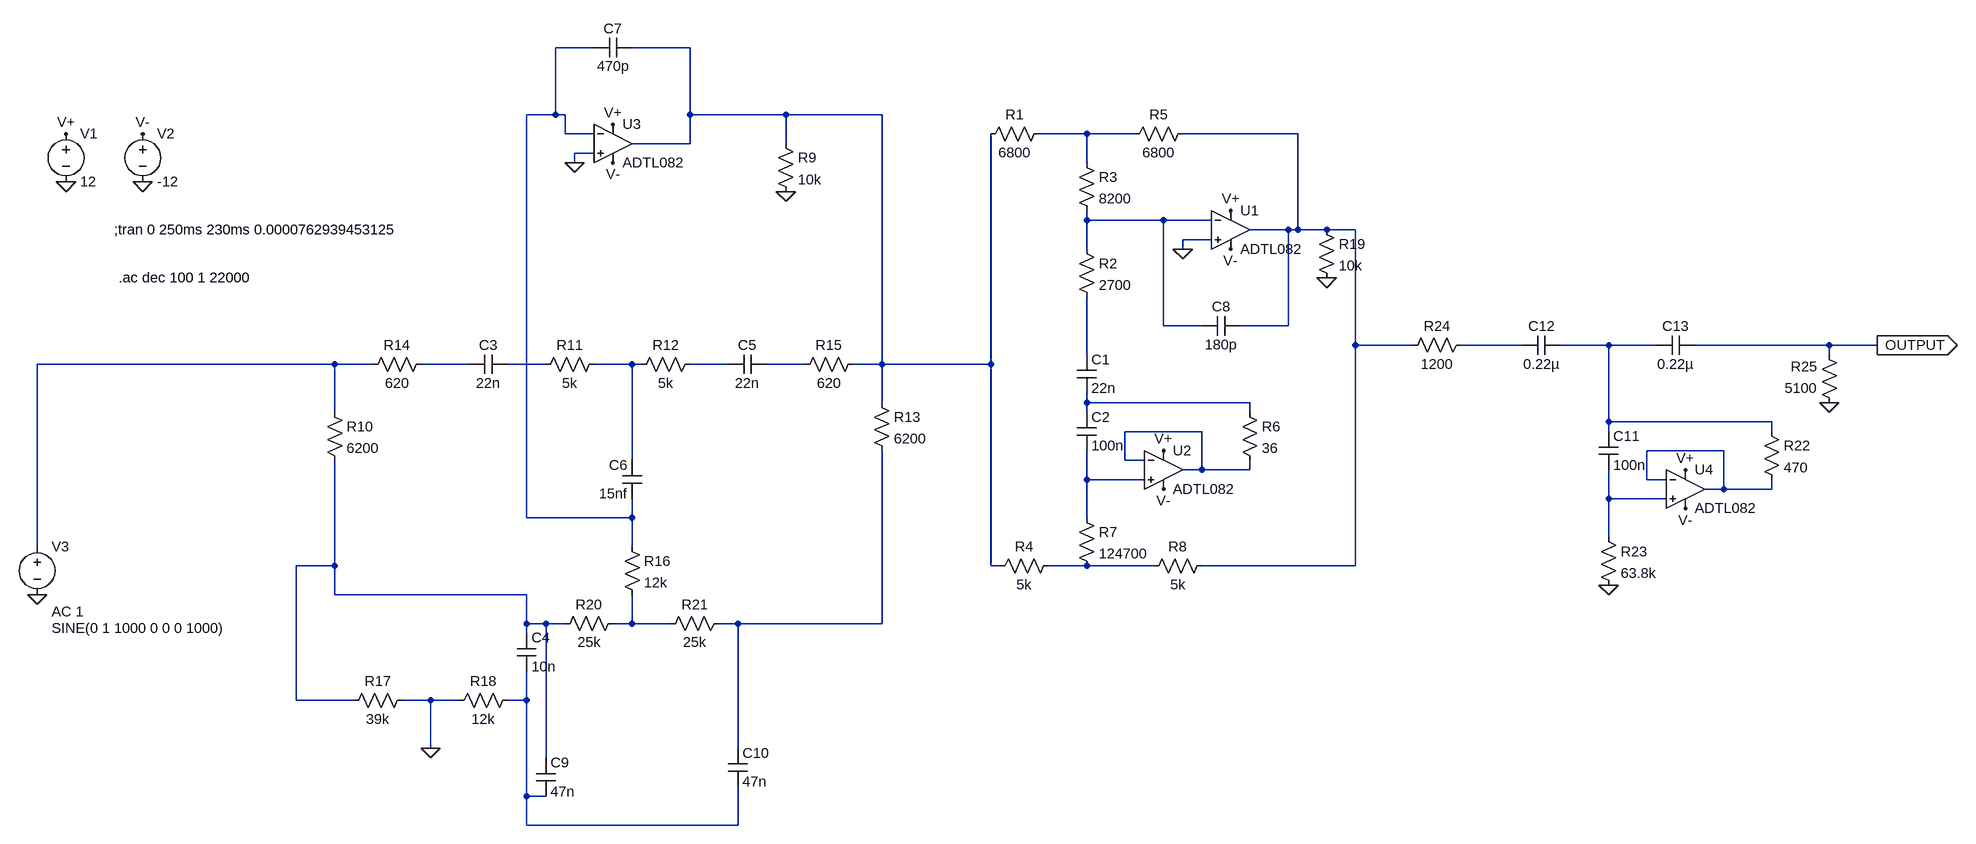
[diagram p0: schematic poormans_1073.asc]
poormans_1073.asc, the LTspice schematic file:
Version 4
SHEET 1 1724 1304
WIRE -1136 -144 -1200 -144
WIRE -976 -144 -1072 -144
WIRE -1200 -32 -1200 -144
WIRE -1200 -32 -1248 -32
WIRE -1184 -32 -1200 -32
WIRE -976 -32 -976 -144
WIRE -816 -32 -976 -32
WIRE -656 -32 -816 -32
WIRE -1184 0 -1184 -32
WIRE -1136 0 -1184 0
WIRE -256 0 -336 0
WIRE -176 0 -256 0
WIRE 96 0 -96 0
WIRE -976 16 -976 -32
WIRE -976 16 -1072 16
WIRE -816 16 -816 -32
WIRE -1136 32 -1168 32
WIRE -1168 48 -1168 32
WIRE -256 48 -256 0
WIRE -256 144 -256 128
WIRE -128 144 -256 144
WIRE -48 144 -128 144
WIRE 80 160 16 160
WIRE 96 160 96 0
WIRE 96 160 80 160
WIRE 144 160 96 160
WIRE 192 160 144 160
WIRE -48 176 -96 176
WIRE -256 192 -256 144
WIRE -96 192 -96 176
WIRE -128 320 -128 144
WIRE -64 320 -128 320
WIRE 80 320 80 160
WIRE 80 320 0 320
WIRE 192 352 192 160
WIRE 288 352 192 352
WIRE 480 352 368 352
WIRE 624 352 544 352
WIRE 704 352 624 352
WIRE 992 352 768 352
WIRE 1072 352 992 352
WIRE -256 368 -256 272
WIRE 992 368 992 352
WIRE -1568 384 -2064 384
WIRE -1504 384 -1568 384
WIRE -1344 384 -1424 384
WIRE -1216 384 -1280 384
WIRE -1072 384 -1136 384
WIRE -1056 384 -1072 384
WIRE -912 384 -976 384
WIRE -784 384 -848 384
WIRE -656 384 -656 -32
WIRE -656 384 -704 384
WIRE -416 384 -416 0
WIRE -416 384 -656 384
WIRE -656 448 -656 384
WIRE -256 448 -256 432
WIRE 16 448 -256 448
WIRE -1568 464 -1568 384
WIRE -256 464 -256 448
WIRE 16 464 16 448
WIRE 624 480 624 352
WIRE 896 480 624 480
WIRE -64 496 -192 496
WIRE 624 496 624 480
WIRE 896 496 896 480
WIRE 816 528 688 528
WIRE -1072 544 -1072 384
WIRE -192 544 -192 496
WIRE -160 544 -192 544
WIRE -64 560 -64 496
WIRE -64 560 -96 560
WIRE 16 560 16 544
WIRE 16 560 -64 560
WIRE -256 576 -256 528
WIRE -160 576 -256 576
WIRE 688 576 688 528
WIRE 720 576 688 576
WIRE 816 592 816 528
WIRE 816 592 784 592
WIRE 896 592 896 576
WIRE 896 592 816 592
WIRE 624 608 624 560
WIRE 720 608 624 608
WIRE -1248 640 -1248 -32
WIRE -1072 640 -1072 608
WIRE -1072 640 -1248 640
WIRE -256 640 -256 576
WIRE 624 672 624 608
WIRE -2064 688 -2064 384
WIRE -1072 688 -1072 640
WIRE -1568 720 -1568 544
WIRE -1568 720 -1632 720
WIRE -416 720 -416 384
WIRE -400 720 -416 720
WIRE -256 720 -320 720
WIRE -144 720 -256 720
WIRE 192 720 192 352
WIRE 192 720 -64 720
WIRE -1568 768 -1568 720
WIRE -1248 768 -1568 768
WIRE -1248 816 -1248 768
WIRE -1216 816 -1248 816
WIRE -1184 816 -1216 816
WIRE -1072 816 -1072 768
WIRE -1072 816 -1104 816
WIRE -1008 816 -1072 816
WIRE -896 816 -928 816
WIRE -656 816 -656 528
WIRE -656 816 -896 816
WIRE -1248 832 -1248 816
WIRE -1632 944 -1632 720
WIRE -1536 944 -1632 944
WIRE -1408 944 -1456 944
WIRE -1360 944 -1408 944
WIRE -1248 944 -1248 896
WIRE -1248 944 -1280 944
WIRE -1408 1024 -1408 944
WIRE -896 1024 -896 816
WIRE -1216 1040 -1216 816
WIRE -1248 1104 -1248 944
WIRE -1216 1104 -1248 1104
WIRE -1248 1152 -1248 1104
WIRE -896 1152 -896 1088
WIRE -896 1152 -1248 1152
FLAG -96 192 0
FLAG -2016 80 0
FLAG 1072 352 OUTPUT
IOPIN 1072 352 Out
FLAG -16 128 V+
FLAG -128 528 V+
FLAG -2016 0 V+
FLAG -1888 80 0
FLAG -1888 0 V-
FLAG -16 192 V-
FLAG -128 592 V-
FLAG -2064 768 0
FLAG -1168 48 0
FLAG -1104 -16 V+
FLAG -1104 48 V-
FLAG -1408 1024 0
FLAG -816 96 0
FLAG 144 240 0
FLAG 752 560 V+
FLAG 752 624 V-
FLAG 624 752 0
FLAG 992 448 0
SYMBOL Opamps\\ADTL082 -16 96 R0
SYMATTR InstName U1
SYMBOL Opamps\\ADTL082 -128 496 R0
SYMATTR InstName U2
SYMBOL res -320 -16 R90
WINDOW 0 0 56 VBottom 2
WINDOW 3 32 56 VTop 2
SYMATTR InstName R1
SYMATTR Value 6800
SYMATTR SpiceLine tol=1 pwr=0.25
SYMBOL res -272 176 R0
SYMATTR InstName R2
SYMATTR Value 2700
SYMATTR SpiceLine tol=1 pwr=0.25
SYMBOL res -272 32 R0
SYMATTR InstName R3
SYMATTR Value 8200
SYMATTR SpiceLine tol=1 pwr=0.25
SYMBOL cap -272 368 R0
SYMATTR InstName C1
SYMATTR Value 22n
SYMATTR SpiceLine V=63
SYMBOL cap -272 464 R0
SYMATTR InstName C2
SYMATTR Value 100n
SYMATTR SpiceLine V=63
SYMBOL res -80 -16 R90
WINDOW 0 0 56 VBottom 2
WINDOW 3 32 56 VTop 2
SYMATTR InstName R5
SYMATTR Value 6800
SYMATTR SpiceLine tol=1 pwr=0.25
SYMBOL res 0 448 R0
SYMATTR InstName R6
SYMATTR Value 36
SYMATTR SpiceLine tol=1 pwr=0.25
SYMBOL res -272 624 R0
SYMATTR InstName R7
SYMATTR Value 124700
SYMATTR SpiceLine tol=1 pwr=0.25
SYMBOL res -304 704 R90
WINDOW 0 0 56 VBottom 2
WINDOW 3 32 56 VTop 2
SYMATTR InstName R4
SYMATTR Value 5k
SYMATTR SpiceLine tol=1 pwr=0.25
SYMBOL res -48 704 R90
WINDOW 0 0 56 VBottom 2
WINDOW 3 32 56 VTop 2
SYMATTR InstName R8
SYMATTR Value 5k
SYMATTR SpiceLine tol=1 pwr=0.25
SYMBOL voltage -2016 -16 R0
WINDOW 123 0 0 Left 0
WINDOW 39 0 0 Left 0
SYMATTR InstName V1
SYMATTR Value 12
SYMBOL voltage -1888 -16 R0
WINDOW 123 0 0 Left 0
WINDOW 39 0 0 Left 0
SYMATTR InstName V2
SYMATTR Value -12
SYMBOL voltage -2064 672 R0
WINDOW 3 24 152 Left 2
WINDOW 123 24 124 Left 2
WINDOW 39 0 0 Left 0
SYMATTR Value SINE(0 1 1000 0 0 0 1000)
SYMATTR Value2 AC 1
SYMATTR InstName V3
SYMBOL res -1120 368 R90
WINDOW 0 0 56 VBottom 2
WINDOW 3 32 56 VTop 2
SYMATTR InstName R11
SYMATTR Value 5k
SYMBOL res -960 368 R90
WINDOW 0 0 56 VBottom 2
WINDOW 3 32 56 VTop 2
SYMATTR InstName R12
SYMATTR Value 5k
SYMBOL Opamps\\ADTL082 -1104 -48 R0
SYMATTR InstName U3
SYMBOL cap -1280 368 R90
WINDOW 0 0 32 VBottom 2
WINDOW 3 32 32 VTop 2
SYMATTR InstName C3
SYMATTR Value 22n
SYMBOL cap -848 368 R90
WINDOW 0 0 32 VBottom 2
WINDOW 3 32 32 VTop 2
SYMATTR InstName C5
SYMATTR Value 22n
SYMBOL cap -1056 608 R180
WINDOW 0 24 56 Left 2
WINDOW 3 24 8 Left 2
SYMATTR InstName C6
SYMATTR Value 15nf
SYMBOL res -1584 448 R0
SYMATTR InstName R10
SYMATTR Value 6200
SYMATTR SpiceLine tol=1 pwr=0.25
SYMBOL res -672 432 R0
SYMATTR InstName R13
SYMATTR Value 6200
SYMBOL res -1408 368 R90
WINDOW 0 0 56 VBottom 2
WINDOW 3 32 56 VTop 2
SYMATTR InstName R14
SYMATTR Value 620
SYMBOL res -688 368 R90
WINDOW 0 0 56 VBottom 2
WINDOW 3 32 56 VTop 2
SYMATTR InstName R15
SYMATTR Value 620
SYMBOL res -1088 672 R0
SYMATTR InstName R16
SYMATTR Value 12k
SYMBOL res -1440 928 R90
WINDOW 0 0 56 VBottom 2
WINDOW 3 32 56 VTop 2
SYMATTR InstName R17
SYMATTR Value 39k
SYMBOL res -1264 928 R90
WINDOW 0 0 56 VBottom 2
WINDOW 3 32 56 VTop 2
SYMATTR InstName R18
SYMATTR Value 12k
SYMBOL cap -1264 832 R0
SYMATTR InstName C4
SYMATTR Value 10n
SYMBOL cap -1072 -160 R90
WINDOW 0 0 32 VBottom 2
WINDOW 3 32 32 VTop 2
SYMATTR InstName C7
SYMATTR Value 470p
SYMBOL res -832 0 R0
SYMATTR InstName R9
SYMATTR Value 10k
SYMBOL res 128 144 R0
SYMATTR InstName R19
SYMATTR Value 10k
SYMBOL cap 0 304 R90
WINDOW 0 0 32 VBottom 2
WINDOW 3 32 32 VTop 2
SYMATTR InstName C8
SYMATTR Value 180p
SYMBOL res -1088 800 R90
WINDOW 0 0 56 VBottom 2
WINDOW 3 32 56 VTop 2
SYMATTR InstName R20
SYMATTR Value 25k
SYMBOL res -912 800 R90
WINDOW 0 0 56 VBottom 2
WINDOW 3 32 56 VTop 2
SYMATTR InstName R21
SYMATTR Value 25k
SYMBOL cap -1232 1040 R0
SYMATTR InstName C9
SYMATTR Value 47n
SYMBOL cap -912 1024 R0
SYMATTR InstName C10
SYMATTR Value 47n
SYMBOL Opamps\\ADTL082 752 528 R0
SYMATTR InstName U4
SYMBOL cap 608 496 R0
SYMATTR InstName C11
SYMATTR Value 100n
SYMATTR SpiceLine V=63
SYMBOL res 880 480 R0
SYMATTR InstName R22
SYMATTR Value 470
SYMATTR SpiceLine tol=1 pwr=0.25
SYMBOL res 608 656 R0
SYMATTR InstName R23
SYMATTR Value 63.8k
SYMATTR SpiceLine tol=1 pwr=0.25
SYMBOL res 384 336 R90
WINDOW 0 0 56 VBottom 2
WINDOW 3 32 56 VTop 2
SYMATTR InstName R24
SYMATTR Value 1200
SYMBOL res 1008 464 R180
WINDOW 0 36 76 Left 2
WINDOW 3 36 40 Left 2
SYMATTR InstName R25
SYMATTR Value 5100
SYMBOL cap 544 336 R90
WINDOW 0 0 32 VBottom 2
WINDOW 3 32 32 VTop 2
SYMATTR InstName C12
SYMATTR Value 0.22µ
SYMBOL cap 768 336 R90
WINDOW 0 0 32 VBottom 2
WINDOW 3 32 32 VTop 2
SYMATTR InstName C13
SYMATTR Value 0.22µ
TEXT -1928 240 Left 2 !.ac dec 100 1 22000
TEXT -1936 160 Left 2 !;tran 0 250ms 230ms 0.0000762939453125

The netlist it stands for:
* poormans_1073.asc
XU1 0 N005 V+ V- N004 ADTL082  ; pins In+ In- V+ V- OUT
XU2 N018 N016 V+ V- N016 ADTL082  ; pins In+ In- V+ V- OUT
R1 N003 N002 6800 tol=1 pwr=0.25
R2 N005 N008 2700 tol=1 pwr=0.25
R3 N003 N005 8200 tol=1 pwr=0.25
C1 N008 N015 22n V=63
C2 N015 N018 100n V=63
R5 N004 N003 6800 tol=1 pwr=0.25
R6 N015 N016 36 tol=1 pwr=0.25
R7 N018 N021 124700 tol=1 pwr=0.25
R4 N021 N002 5k tol=1 pwr=0.25
R8 N004 N021 5k tol=1 pwr=0.25
V1 V+ 0 12
V2 V- 0 -12
V3 N009 0 SINE(0 1 1000 0 0 0 1000) AC 1
R11 N012 N011 5k
R12 N013 N012 5k
XU3 0 N001 V+ V- N002 ADTL082  ; pins In+ In- V+ V- OUT
C3 N011 N010 22n
C5 N014 N013 22n
C6 N001 N012 15nf
R10 N009 N020 6200 tol=1 pwr=0.25
R13 N002 N023 6200
R14 N010 N009 620
R15 N002 N014 620
R16 N001 N022 12k
R17 0 N020 39k
R18 N024 0 12k
C4 N020 N024 10n
C7 N002 N001 470p
R9 N002 0 10k
R19 N004 0 10k
C8 N004 N005 180p
R20 N022 N020 25k
R21 N023 N022 25k
C9 N020 N024 47n
C10 N023 N024 47n
XU4 N019 N017 V+ V- N017 ADTL082  ; pins In+ In- V+ V- OUT
C11 N007 N019 100n V=63
R22 N007 N017 470 tol=1 pwr=0.25
R23 N019 0 63.8k tol=1 pwr=0.25
R24 N006 N004 1200
R25 0 OUTPUT 5100
C12 N007 N006 0.22µ
C13 OUTPUT N007 0.22µ
.ac dec 100 1 22000
;tran 0 250ms 230ms 0.0000762939453125
.lib ADI.lib
.backanno
.end